# Altium schematic sheet B293A CoX Amp with Programmable Gain.SchDoc
size A4
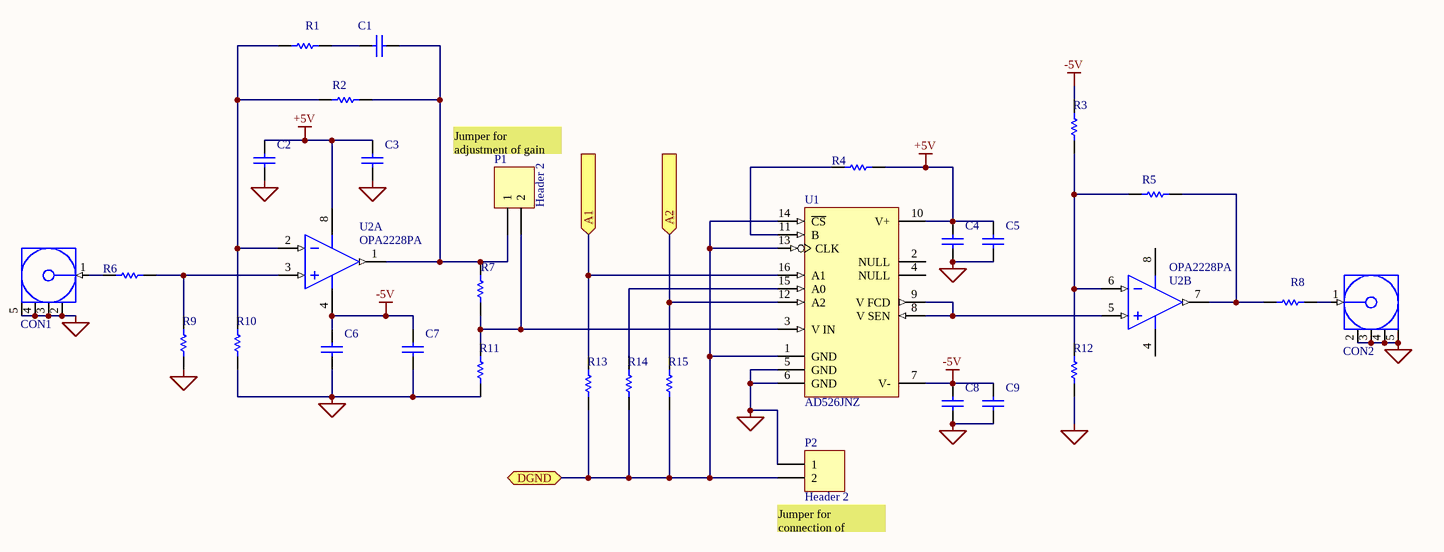
[diagram p0: B293A CoX Amp with Programmable Gain.SchDoc]

## Parts
C1  CAP 47pF 50V 1206(3216)  [CAPC1206(3216)170_M]  (value not drawn)
C2  CAP 10uF 50V 1206(3216)  [CAPC1206(3216)190_M]  (value not drawn)
C3  CAP 10nF 50V 1206(3216)  [CAPC1206(3216)170_M]  (value not drawn)
C4  CAP 10nF 50V 1206(3216)  [CAPC1206(3216)170_M]  (value not drawn)
C5  CAP 10uF 50V 1206(3216)  [CAPC1206(3216)190_M]  (value not drawn)
C6  CAP 10nF 50V 1206(3216)  [CAPC1206(3216)170_M]  (value not drawn)
C7  CAP 10uF 50V 1206(3216)  [CAPC1206(3216)190_M]  (value not drawn)
C8  CAP 10nF 50V 1206(3216)  [CAPC1206(3216)170_M]  (value not drawn)
C9  CAP 10uF 50V 1206(3216)  [CAPC1206(3216)190_M]  (value not drawn)
CON1  SMA Vertical  [SMA Vertical]  (value not drawn)
CON2  SMA Vertical  [SMA Vertical]  (value not drawn)
P1  Header 2  [HDR1X2]
P2  Header 2  [HDR1X2]
R1  1K5 1% 1206(3216)  [RESC1206(3216)_L]  (value not drawn)
R2  100K 1% 1206(3216)  [RESC1206(3216)_L]  (value not drawn)
R3  150K 1% 1206(3216)  [RESC1206(3216)_L]  (value not drawn)
R4  10K 1% 1206(3216)  [RESC1206(3216)_L]  (value not drawn)
R5  10K 1% 1206(3216)  [RESC1206(3216)_L]  (value not drawn)
R6  100R 1% 1206(3216)  [RESC1206(3216)_N]  (value not drawn)
R7  10K 1% 1206(3216)  [RESC1206(3216)_L]  (value not drawn)
R8  100R 1% 1206(3216)  [RESC1206(3216)_N]  (value not drawn)
R9  27K 1% 1206(3216)  [RESC1206(3216)_M]  (value not drawn)
R10  330R 1% 1206(3216)  [RESC1206(3216)_M]  (value not drawn)
R11  1K2 1% 1206(3216)  [RESC1206(3216)_M]  (value not drawn)
R12  1K2 1% 1206(3216)  [RESC1206(3216)_M]  (value not drawn)
R13  10K 1% 1206(3216)  [RESC1206(3216)_L]  (value not drawn)
R14  10K 1% 1206(3216)  [RESC1206(3216)_L]  (value not drawn)
R15  10K 1% 1206(3216)  [RESC1206(3216)_L]  (value not drawn)
U1  AD526JNZ  [D-16_B]
U2  OPA2228PA  [TI-P8]  (parts A,B of 2)

## Ports
A1 (in), A2 (in), DGND

## Nets
+5V: C2.2 C3.2 C4.2 C5.2 R4.1 U1.10(V+) U2.8(V+)
-5V: C6.2 C7.2 C8.2 C9.2 R3.2 U1.7(V-) U2.4(V-)
GND: C2.1 C3.1 C4.1 C5.1 C6.1 C7.1 C8.1 C9.1 CON1.2(GND) CON1.3(GND) CON1.4(GND) CON1.5(GND) CON2.2(GND) CON2.3(GND) CON2.4(GND) CON2.5(GND) P2.1 R9.1 R10.1 R11.1 R12.1 U1.5(GND) U1.6(GND)
A1: R13.2 U1.16(A1) ; port A1
A2: R15.2 U1.12(A2) ; port A2
DGND: P2.2 R13.1 R14.1 R15.1 U1.1(GND) U1.13(CLK) U1.14(~{CS}) ; port DGND
NetC1_1: C1.1 P1.1 R2.2 R7.2 U2.1(OUT_A)
NetC1_2: C1.2 R1.2
NetCON1_1: CON1.1(Signal) R6.2
NetCON2_1: CON2.1(Signal) R8.2
NetP1_2: P1.2 R7.1 R11.2 U1.3(V_IN)
NetR1_1: R1.1 R2.1 R10.2 U2.2(IN_A-)
NetR3_1: R3.1 R5.1 R12.2 U2.6(IN_B-)
NetR4_2: R4.2 U1.11(B)
NetR5_2: R5.2 R8.1 U2.7(OUT_B)
NetR6_1: R6.1 R9.2 U2.3(IN_A+)
NetR14_2: R14.2 U1.15(A0)
NetU1_8: U1.8(V_SEN) U1.9(V_FCD) U2.5(IN_B+)

Not connected (* = marked no-connect by the designer): U1 2(NULL) 4(NULL)

## Notes on the sheet
- Jumper for adjustment of gain
- (near P2) Jumper for connection of grounds

## Library data of the parts
C1 = CMP-1037-01292-1: CAP 47pF 50V ±10% 1206 (3216 Metric) Thickness 1.7mm SMD; Case-EIA: 1206; Case-Metric: 3216; Technology: SMT; Tolerance: ±10%; Rated Voltage: 50 V; Value: 47pF; Max Thickness: 1.7 mm
C2 C5 C7 C9 = CMP-1037-04982-1: CAP 10uF 50V ±10% 1206 (3216 Metric) Thickness 1.9mm SMD; Case-EIA: 1206; Case-Metric: 3216; Technology: SMT; Tolerance: ±10%; Max Thickness: 1.9 mm; Value: 10uF; Rated Voltage: 50 V
C3 C4 C6 C8 = CMP-1037-03512-1: CAP 10nF 50V ±10% 1206 (3216 Metric) Thickness 1.7mm SMD; Case-Metric: 3216; Case-EIA: 1206; Value: 10nF; Max Thickness: 1.7 mm; Technology: SMT; Rated Voltage: 50 V; Tolerance: ±10%
CON1 CON2 = SMA Vertical: Manufacturers Part No: 5-1814832-1; Order Code: 1248990; Supplier: Onecall
P1 P2 = Header 2: Header, 2-Pin; LatestRevisionDate: 17-Jul-2002; LatestRevisionNote: Re-released for DXP Platform.; Publisher: Altium Limited
R1 = CMP-1014-00528-1: 1K5 0.25W 1% 1206 (3216 Metric)  SMD; Case-EIA: 1206; Case-Metric: 3216; Value: 1500.00 Ohm; Tolerance: 1 %; Technology: SMT
R2 = CMP-1014-00736-1: 100K 0.25W 1% 1206 (3216 Metric)  SMD; Case-EIA: 1206; Value: 100000.00 Ohm; Case-Metric: 3216; Tolerance: 1 %; Technology: SMT
R3 = CMP-1014-00754-1: 150K 0.25W 1% 1206 (3216 Metric)  SMD; Case-EIA: 1206; Value: 150000.00 Ohm; Case-Metric: 3216; Technology: SMT; Tolerance: 1 %
R4 R5 R7 R13-R15 = CMP-1014-00623-1: 10K 0.25W 1% 1206 (3216 Metric)  SMD; Case-Metric: 3216; Value: 10000.00 Ohm; Case-EIA: 1206; Technology: SMT; Tolerance: 1 %
R6 R8 = CMP-1014-00397-1: 100R 0.25W 1% 1206 (3216 Metric)  SMD; Value: 100.00 Ohm; Case-Metric: 3216; Case-EIA: 1206; Technology: SMT; Tolerance: 1 %
R9 = CMP-1014-00670-1: 27K 0.25W 1% 1206 (3216 Metric)  SMD; Value: 27000.00 Ohm; Case-EIA: 1206; Case-Metric: 3216; Tolerance: 1 %; Technology: SMT
R10 = CMP-1014-00454-1: 330R 0.25W 1% 1206 (3216 Metric)  SMD; Case-Metric: 3216; Value: 330.00 Ohm; Case-EIA: 1206; Technology: SMT; Tolerance: 1 %
R11 R12 = CMP-1014-00518-1: 1K2 0.25W 1% 1206 (3216 Metric)  SMD; Case-Metric: 3216; Case-EIA: 1206; Value: 1200.00 Ohm; Technology: SMT; Tolerance: 1 %
U1 = AD526AD: Software Programmable Gain Amplifier; Note: Pins 6 and 7 are analog ground; Pin 1 is digital ground.; Published: 8-Jun-2000; LatestRevisionDate: 4-Mar-2005; LatestRevisionNote: Stylized 3D Model Added.; DatasheetDocument: 1999; PackageDocument: revB, 1996; PackageReference: D-16_B; Publisher: Altium Limited; ComponentLink1Description: Manufacturer Link; ComponentLink1URL: http://www.analog.com/
U2 = CMP-0272-01557-2: High Precision, Low Noise Operational Amplifier, 5 to 36 V, -55 to 125 degC, 8-pin DIP (P8), Green (RoHS & no Sb/Br); Manufacturer: Texas Instruments; PackageReference: P8; ComponentLink1Description: Manufacturer URL; ComponentLink1URL: http://www.ti.com/; PackageVersion: 4040082/E, 04/2010; ComponentLink3URL: http://www.ti.com/litv/pdf/mpdi001b; DatasheetVersion: SBOS110A; ComponentLink2URL: http://www.ti.com/lit/ds/symlink/opa2228.pdf; ComponentLink3Description: Package Specification; PackageDescription: 8-Pin Plastic In-Line, Body 9.59 x 6.35 mm, Pitch 2.54 mm; Code_JEDEC: MS-001; ComponentLink2Description: Datasheet